# Altium schematic sheet PLBank33.SchDoc
size A4; SheetNumber: 10; SheetTotal: 18
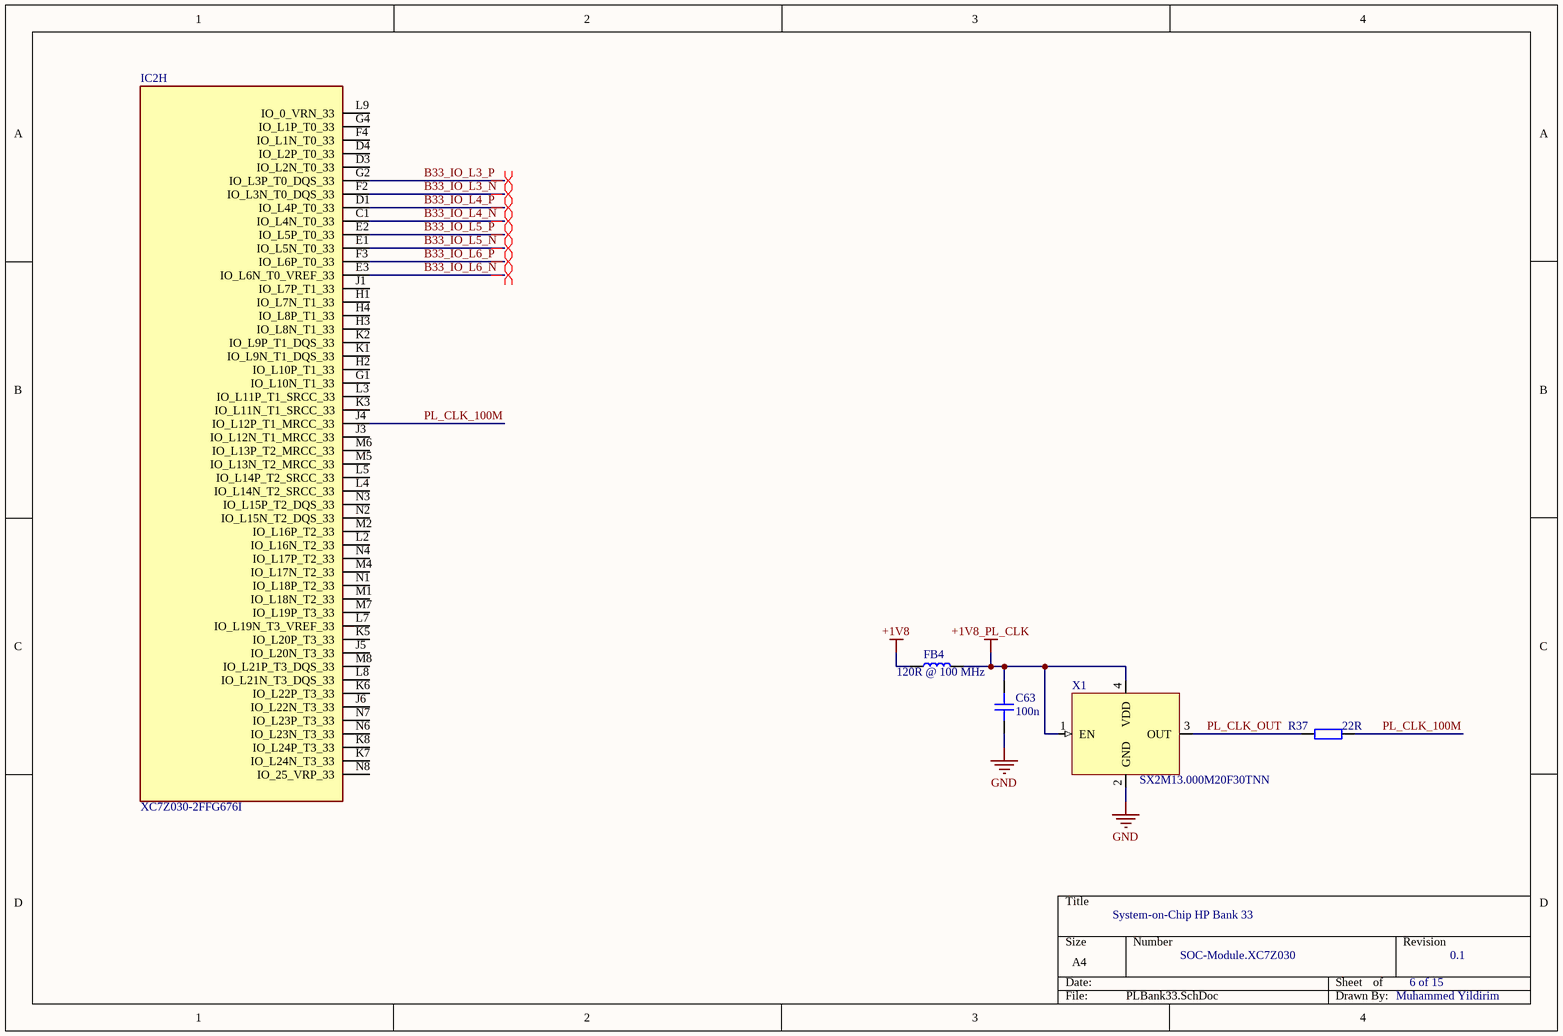
[diagram p0: PLBank33.SchDoc]

## Parts
C63  100n  [CAP_0201]
FB4  120R @ 100 MHz  [IND_0201]
IC2  XC7Z030-2FFG676I  [BGA676C100P26X26_2700X2700X324]  (part H of 15)
R37  22R  [RES_0201]
X1  SX2M13.000M20F30TNN  [XTAL_2520]

## Nets
+1V8: FB4.1
+1V8_PL_CLK: C63.1 FB4.2 X1.1(EN) X1.4(VDD)
GND: C63.2 X1.2(GND)
B33_IO_L3_N: IC2.F2(IO_L3N_T0_DQS_33)
B33_IO_L3_P: IC2.G2(IO_L3P_T0_DQS_33)
B33_IO_L4_N: IC2.C1(IO_L4N_T0_33)
B33_IO_L4_P: IC2.D1(IO_L4P_T0_33)
B33_IO_L5_N: IC2.E1(IO_L5N_T0_33)
B33_IO_L5_P: IC2.E2(IO_L5P_T0_33)
B33_IO_L6_N: IC2.E3(IO_L6N_T0_VREF_33)
B33_IO_L6_P: IC2.F3(IO_L6P_T0_33)
PL_CLK_100M: IC2.J4(IO_L12P_T1_MRCC_33) R37.2
PL_CLK_OUT: R37.1 X1.3(OUT)

Not connected (* = marked no-connect by the designer): IC2 D3(IO_L2N_T0_33) D4(IO_L2P_T0_33) F4(IO_L1N_T0_33) G1(IO_L10N_T1_33) G4(IO_L1P_T0_33) H1(IO_L7N_T1_33) H2(IO_L10P_T1_33) H3(IO_L8N_T1_33) H4(IO_L8P_T1_33) J1(IO_L7P_T1_33) J3(IO_L12N_T1_MRCC_33) J5(IO_L20N_T3_33) J6(IO_L22N_T3_33) K1(IO_L9N_T1_DQS_33) K2(IO_L9P_T1_DQS_33) K3(IO_L11N_T1_SRCC_33) K5(IO_L20P_T3_33) K6(IO_L22P_T3_33) K7(IO_L24N_T3_33) K8(IO_L24P_T3_33) L2(IO_L16N_T2_33) L3(IO_L11P_T1_SRCC_33) L4(IO_L14N_T2_SRCC_33) L5(IO_L14P_T2_SRCC_33) L7(IO_L19N_T3_VREF_33) L8(IO_L21N_T3_DQS_33) L9(IO_0_VRN_33) M1(IO_L18N_T2_33) M2(IO_L16P_T2_33) M4(IO_L17N_T2_33) M5(IO_L13N_T2_MRCC_33) M6(IO_L13P_T2_MRCC_33) M7(IO_L19P_T3_33) M8(IO_L21P_T3_DQS_33) N1(IO_L18P_T2_33) N2(IO_L15N_T2_DQS_33) N3(IO_L15P_T2_DQS_33) N4(IO_L17P_T2_33) N6(IO_L23N_T3_33) N7(IO_L23P_T3_33) N8(IO_25_VRP_33)

## Layout directives
differential pair: B33_IO_L3_N, B33_IO_L3_P, B33_IO_L4_N, B33_IO_L4_P, B33_IO_L5_N, B33_IO_L5_P, B33_IO_L6_N, B33_IO_L6_P

## Notes on the sheet
- System-on-Chip HP Bank 33
- SOC-Module.XC7Z030
- 6 of 15
- 0.1
- Muhammed Yildirim

## Library data of the parts
C63 = CAP_0201: Capacitor SMD 0201; Manufacturer: *; Manufacturer Part Number: *; Distributor Link: *; LCSC: *; Rating: *; Dielectric: *
FB4 = IND_0201: Inductor SMD 0201; Manufacturer_Name: Murata Electronics; Manufacturer_Part_Number: LQP03HQ56NH02D; Datasheet Link: https://psearch.en.murata.com/inductor/product/LQP03HQ56NH02%23.html; Height: 0.42mm; Mouser Part Number: 81-LQP03HQ56NH02D; Mouser Price/Stock: https://www.mouser.co.uk/ProductDetail/Murata-Electronics/LQP03HQ56NH02D?qs=B6kkDfuK7%2FBQu1Ob9%2FT2Bg%3D%3D
IC2 = XC7Z030-2FFG676I: Integrated Circuit; Manufacturer_Name: AMD; Datasheet Link: http://www.xilinx.com/support/documentation/data_sheets/ds190-Zynq-7000-Overview.pdf; Height: 3.24mm; Manufacturer_Part_Number: XC7Z030-2FFG676I; Mouser Part Number: 217-XC7Z030-2FFG676I; Mouser Price/Stock: https://www.mouser.co.uk/ProductDetail/Xilinx/XC7Z030-2FFG676I?qs=rrS6PyfT74cuZK5O3CSpmw%3D%3D
R37 = RES_0201: Resistor SMD 0201; Manufacturer: *; Manufacturer Part Number: *; Distributor Link: *; LCSC: *
X1 = ECS-2520MV-130-BN-TR: Standard Clock Oscillators XO (Standard),13MHz,Standby (Power Down),CMOS, Multi-Volt,1.6 V 3.6 V,+/-50ppm,-40 C 85 C,6mA,Surface Mount,4-SMD, No Lead,(2.50mm x 2.00mm),(0.80mm); Manufacturer: ECS; Manufacturer Part Number: ECS-2520MV-130-BN-TR